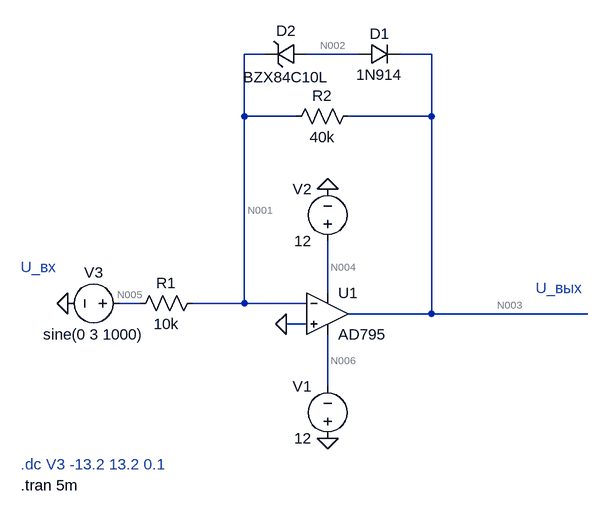
[diagram p0: schematic s2.asc]
s2.asc, the LTspice schematic file:
Version 4.1
SHEET 1 880 680
WIRE 96 -256 64 -256
WIRE 240 -256 160 -256
WIRE 352 -256 304 -256
WIRE 64 -160 64 -256
WIRE 144 -160 64 -160
WIRE 352 -160 352 -256
WIRE 352 -160 224 -160
WIRE 192 112 192 32
WIRE -96 128 -128 128
WIRE 64 128 64 -160
WIRE 64 128 -16 128
WIRE 160 128 64 128
WIRE 352 144 352 -160
WIRE 352 144 224 144
WIRE 592 144 352 144
WIRE 160 160 128 160
WIRE 192 256 192 176
FLAG 192 336 0
FLAG 192 -48 0
FLAG -208 128 0
FLAG 128 160 0
SYMBOL OpAmps\\AD795 192 80 R0
SYMATTR InstName U1
SYMBOL voltage 192 352 R180
WINDOW 0 24 96 Left 2
WINDOW 3 24 16 Left 2
SYMATTR InstName V1
SYMATTR Value 12
SYMBOL voltage 192 48 R180
WINDOW 0 24 96 Left 2
WINDOW 3 24 16 Left 2
SYMATTR InstName V2
SYMATTR Value 12
SYMBOL res 0 112 R90
WINDOW 0 0 56 VBottom 2
WINDOW 3 32 56 VTop 2
SYMATTR InstName R1
SYMATTR Value 10k
SYMBOL res 240 -176 R90
WINDOW 0 0 56 VBottom 2
WINDOW 3 32 56 VTop 2
SYMATTR InstName R2
SYMATTR Value 40k
SYMBOL voltage -112 128 R90
WINDOW 0 -32 56 VBottom 2
WINDOW 3 32 56 VTop 2
SYMATTR InstName V3
SYMATTR Value sine(0 3 1000)
SYMBOL diode 240 -240 R270
WINDOW 0 32 32 VTop 2
WINDOW 3 0 32 VBottom 2
SYMATTR InstName D1
SYMATTR Value 1N914
SYMBOL zener 160 -272 R90
WINDOW 0 -4 32 VBottom 2
WINDOW 3 36 32 VTop 2
SYMATTR InstName D2
SYMATTR Value BZX84C10L
TEXT -280 72 Left 2 ;U_вх
TEXT 512 104 Left 2 ;U_вых
TEXT -280 376 Left 2 ;.dc V3 -13.2 13.2 0.1
TEXT -280 408 Left 2 !.tran 5m

The netlist it stands for:
* s2.asc
X§U1 0 N001 N004 N006 N003 AD795  ; pins In+ In- V+ V- OUT
V1 0 N006 12
V2 N004 0 12
R1 N001 N005 10k
R2 N003 N001 40k
V3 N005 0 sine(0 3 1000)
D1 N002 N003 1N914
D2 N002 N001 BZX84C10L
.model D D
.lib standard.dio
* U_вх
* U_вых
* .dc V3 -13.2 13.2 0.1
.tran 5m
.lib ADI1.lib
.backanno
.end

* Results of the author's LTspice run, read from the files saved beside the schematic
* Operating Point, zero values left out:
*   V(n004) = 12 V
*   V(n006) = -12 V
*   I(V1) = -1.226 mA
*   I(V2) = -1.226 mA
*   Ix(u1:3) = 1.226 mA
*   Ix(u1:4) = -1.226 mA
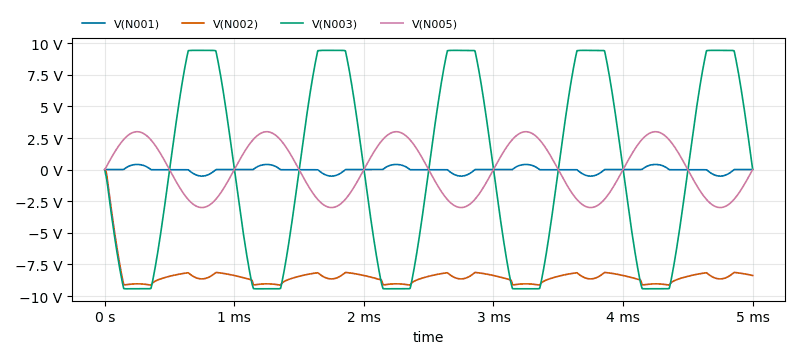
[diagram p1: Transient Analysis of s2.asc, plotted from the saved traces]
* Transient Analysis, 1 run:
*   V(N001): min -513.1 mV, max 408.8 mV, average -12.91 mV, rms 221.7 mV, last 9.114 mV
*   V(N002): min -9.136 V, max 6.206 mV, average -8.465 V, rms 8.511 V, last -8.373 V
*   V(N003): min -9.426 V, max 9.435 V, average 7.476 mV, rms 7.539 V, last 50.24 mV
*   V(N005): min -3 V, max 3 V, average 1.221 µV, rms 2.121 V, last 0 V